# Altium project MB1312.PrjPCB (part 2 of 2)
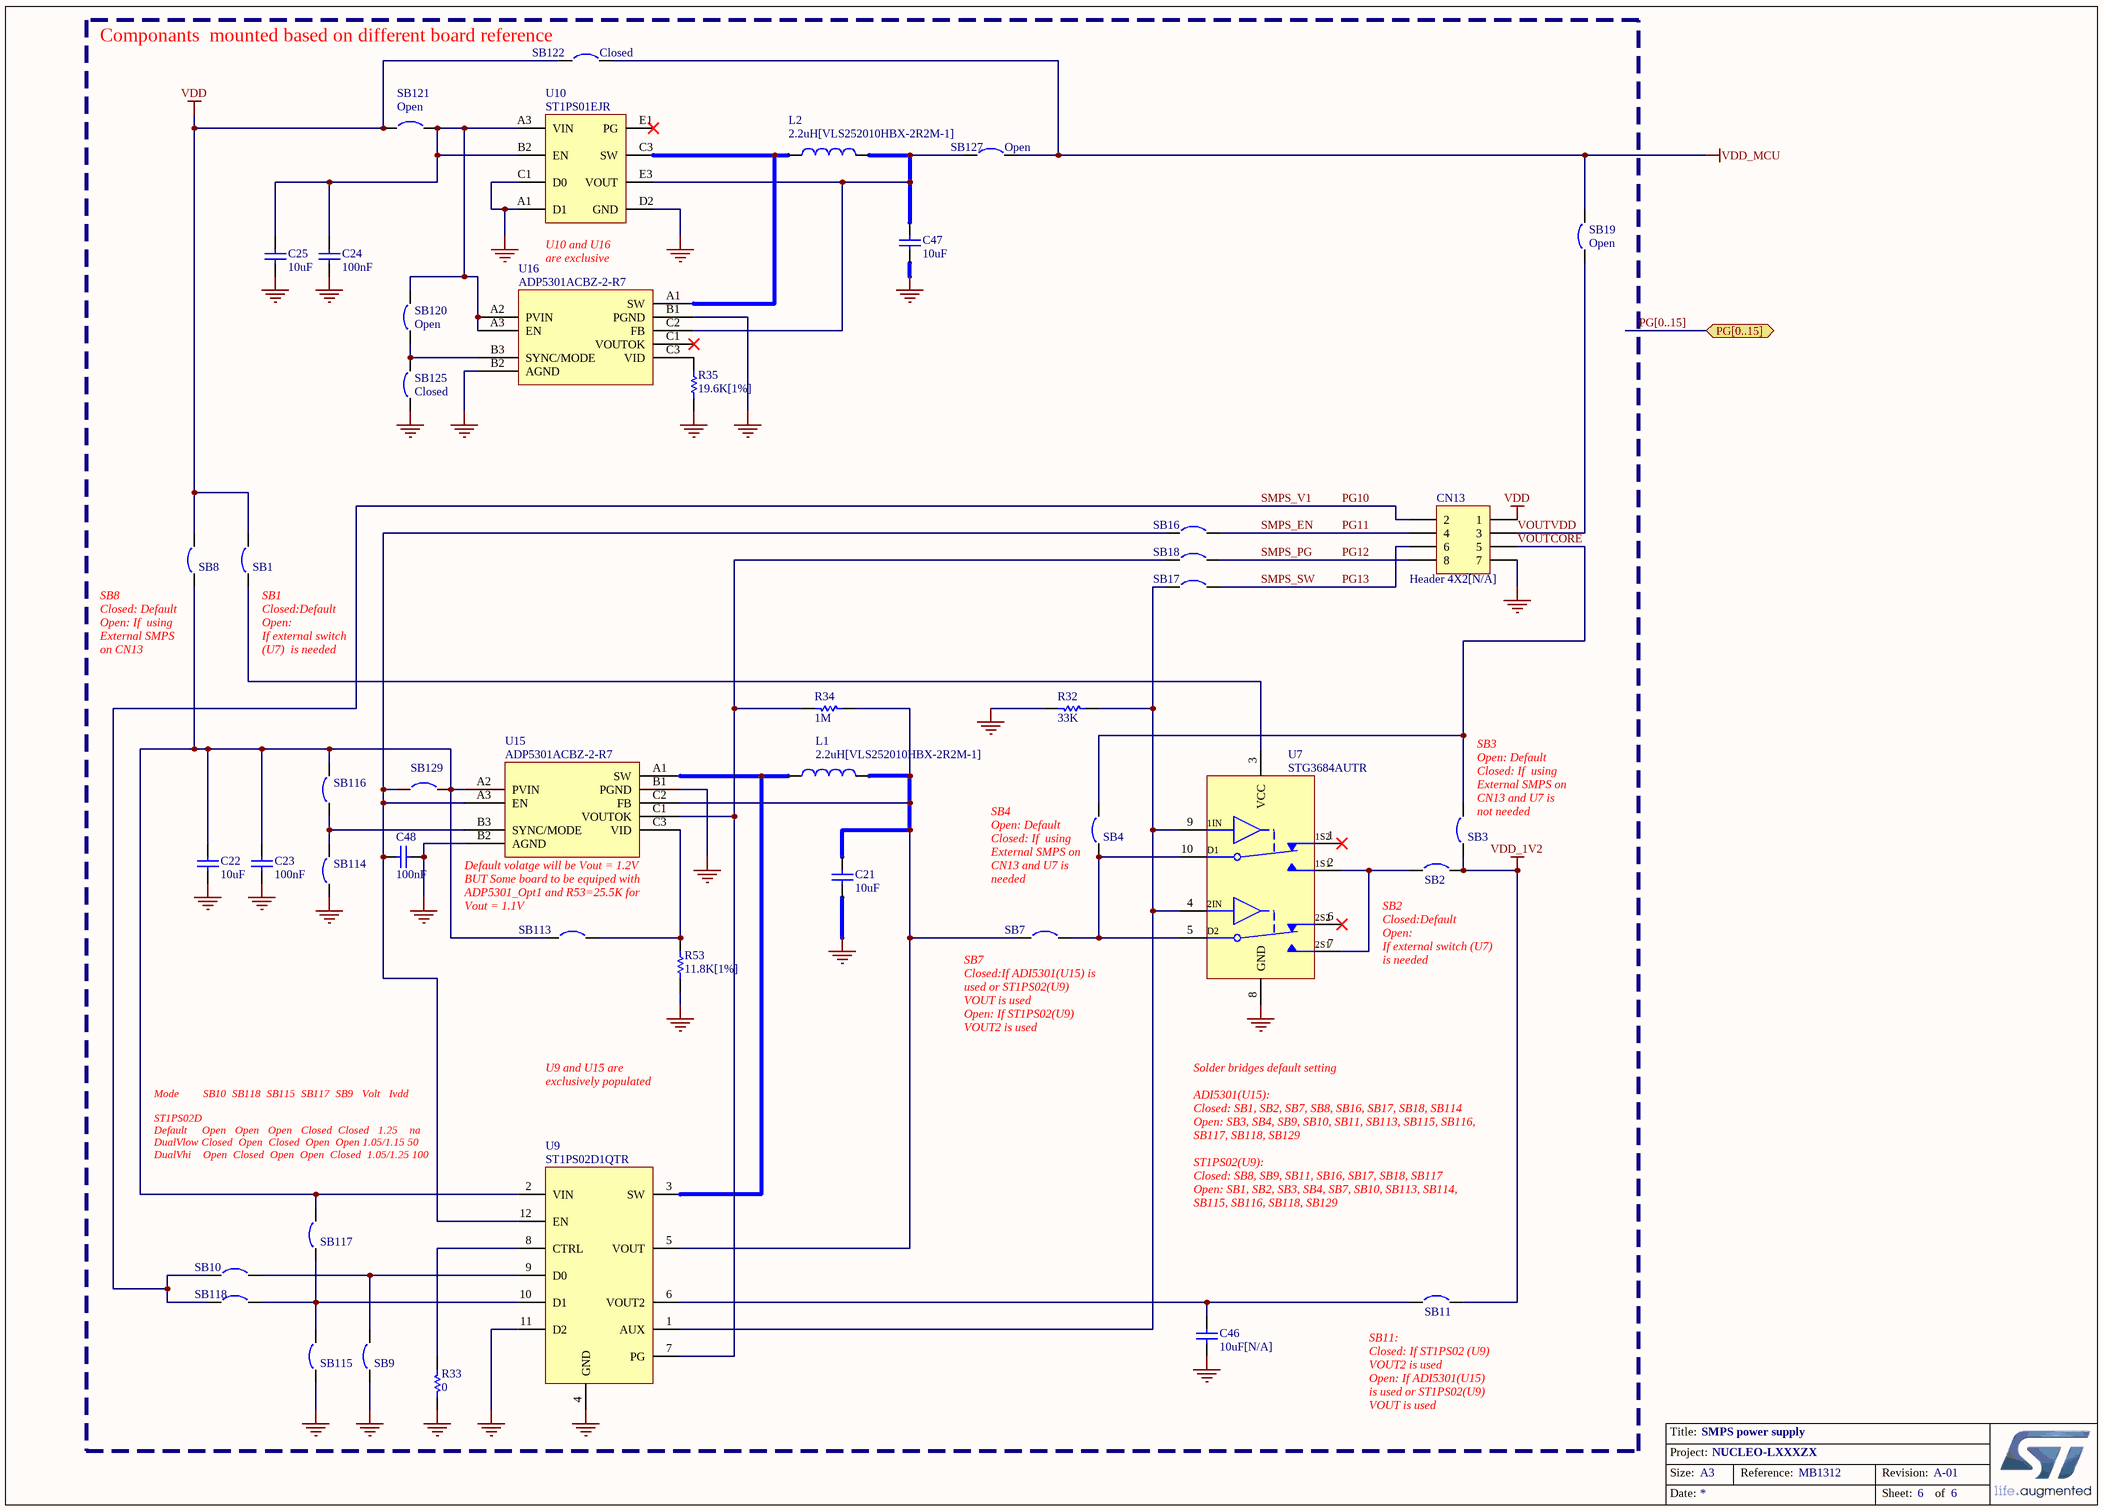
[diagram p6: SMPS power supply.SchDoc]

## Nets that join several sheets
+3V3: MB1312 (JP5.1 SB5.1 SB6.2), Connectors (CN8.7 CN11.16 SB111.1)
+3V3_PER: MB1312 (SB5.2), Connectors (SB110.1 U8.5), ST_LINK_V2-1 (R23.1), USB (R41.2 R45.2 R51.1)
+5V: MB1312 (9 pins), Connectors (CN8.9 CN11.18), ST_LINK_V2-1 (D2.1), USB (U12.5)
AGND: STM32L_144 (7 pins), Connectors (C45.2 CN10.3 CN12.32)
AVDD: STM32L_144 (5 pins), Connectors (CN10.1)
E5V: MB1312 (JP6.2), Connectors (CN11.6), ST_LINK_V2-1 (D3.1)
GND: MB1312 (14 pins), STM32L_144 (40 pins), Connectors (27 pins), ST_LINK_V2-1 (48 pins), USB (15 pins), SMPS power supply (27 pins)
U5V: MB1312 (6 pins), Connectors (CN12.8), ST_LINK_V2-1 (5 pins)
VBAT: STM32L_144 (C60.1 SB154.2 U11.6), Connectors (CN11.33)
VDD: MB1312 (JP5.2), STM32L_144 (8 pins), Connectors (CN11.5), SMPS power supply (5 pins)
VDD_1V2: STM32L_144 (C39.2 C55.2 SB15.2 SB139.2), SMPS power supply (SB2.2 SB3.1 SB11.2)
VDD_MCU: STM32L_144 (24 pins), Connectors (SB112.1), ST_LINK_V2-1 (C44.1 U14.8), SMPS power supply (SB19.2 SB122.2 SB127.2)
VIN: MB1312 (C18.1 U5.3), Connectors (CN8.15 CN11.24)
VIN_5V: MB1312 (C17.1 JP6.8 U5.2 U5.4), ST_LINK_V2-1 (D4.1)
VREF+: STM32L_144 (C56.1 C57.1 SB149.2 U11.32), Connectors (C45.1 SB119.1)
MCO: STM32L_144 (SB148.2), ST_LINK_V2-1 (SB109.1)
NetC42_1: STM32L_144 (R54.1), USB (6 pins)
NetCN6_1: STM32L_144 (SB131.2), ST_LINK_V2-1 (CN6.1 U2.13)
NetCN6_2: STM32L_144 (SB130.2), ST_LINK_V2-1 (CN6.2 U2.12)
NetCN14_2: STM32L_144 (SB142.1), USB (CN14.2 U13.1 U13.6)
NetCN14_3: STM32L_144 (SB143.1), USB (CN14.3 R50.1 U13.3 U13.4)
NetCN14_4: STM32L_144 (SB134.1), USB (CN14.4 D6.1)
NetJP4_1: STM32L_144 (JP4.1), USB (SB198.2 SB199.1)
NetR26_2: MB1312 (R26.2 U4.3), ST_LINK_V2-1 (U2.28)
NRST: STM32L_144 (B2.2 B2.3 C41.2 U11.25), Connectors (CN8.5 CN11.14), ST_LINK_V2-1 (JP3.2)
PA0: STM32L_144 (SB178.2 U11.34), Connectors (CN11.28 SB179.1)
PA1: STM32L_144 (U11.35), Connectors (CN10.11 CN11.30)
PA2: STM32L_144 (U11.36), Connectors (CN12.35 SB150.1)
PA3: STM32L_144 (U11.37), Connectors (CN9.1 CN12.37)
PA4: STM32L_144 (U11.40), Connectors (CN11.32 SB126.1 SB133.1)
PA5: STM32L_144 (U11.41), Connectors (CN7.10 CN12.11 SB123.2)
PA6: STM32L_144 (U11.42), Connectors (CN7.12 CN12.13)
PA7: STM32L_144 (U11.43), Connectors (CN7.14 CN12.15)
PA8: STM32L_144 (TP1.1 U11.100), Connectors (CN12.23)
PA9: STM32L_144 (SB135.2 U11.101), Connectors (CN12.21)
PA10: STM32L_144 (SB134.2 U11.102), Connectors (CN12.33)
PA11: STM32L_144 (SB142.2 U11.103), Connectors (CN12.14)
PA12: STM32L_144 (SB143.2 U11.104), Connectors (CN12.12)
PA13: STM32L_144 (U11.105), Connectors (CN11.13), ST_LINK_V2-1 (SB106.1)
PA14: STM32L_144 (U11.109), Connectors (CN11.15), ST_LINK_V2-1 (SB102.1)
PA15: STM32L_144 (U11.110), Connectors (CN11.17)
PB0: STM32L_144 (U11.46), Connectors (SB144.2 SB159.1 SB182.1)
PB1: STM32L_144 (U11.47), Connectors (CN10.7 CN12.24)
PB2: STM32L_144 (U11.48), Connectors (CN9.13 CN12.22)
PB3: STM32L_144 (SB161.2 SB162.2), Connectors (CN7.15 CN12.31), ST_LINK_V2-1 (SB141.2)
PB4: STM32L_144 (SB163.2 SB164.2), Connectors (CN12.27 SB128.1 SB140.1)
PB5: STM32L_144 (SB165.2 SB176.2), Connectors (CN7.13 CN12.29)
PB6: STM32L_144 (SB174.2 SB175.2), Connectors (CN9.15 CN12.17)
PB7: STM32L_144 (R30.1 SB172.2 SB173.2), Connectors (CN11.21)
PB8: STM32L_144 (SB181.2 SB184.2), Connectors (CN7.2 CN12.3 SB153.2)
PB9: STM32L_144 (SB185.2 SB186.2), Connectors (CN7.4 CN12.5 SB151.2)
PB10: STM32L_144 (U11.69), Connectors (CN12.25 SB155.1 SB188.2)
PB11: STM32L_144 (SB138.2), Connectors (CN10.34 CN12.18)
PB12: STM32L_144 (U11.73), Connectors (CN7.7 CN12.16)
PB13: STM32L_144 (U11.74), Connectors (CN7.5 CN12.30)
PB14: STM32L_144 (SB132.1 U11.75), Connectors (CN12.28)
PB15: STM32L_144 (U11.76), Connectors (CN7.3 CN12.26)
PC0: STM32L_144 (U11.26), Connectors (CN9.3 CN11.38)
PC1: STM32L_144 (U11.27), Connectors (CN9.7 CN11.36)
PC2: STM32L_144 (U11.28), Connectors (CN10.9 CN11.35)
PC3: STM32L_144 (U11.29), Connectors (CN9.5 CN11.37)
PC4: STM32L_144 (U11.44), Connectors (CN9.9 CN12.34 SB151.1)
PC5: STM32L_144 (U11.45), Connectors (CN9.11 CN12.6 SB153.1)
PC6: STM32L_144 (U11.96), Connectors (CN7.1 CN12.4)
PC7: STM32L_144 (U11.97), Connectors (CN12.19 SB124.1)
PC8: STM32L_144 (U11.98), Connectors (CN8.2 SB137.1)
PC9: STM32L_144 (U11.99), Connectors (CN8.4 SB136.1)
PC10: STM32L_144 (U11.111), Connectors (CN8.6 CN11.1)
PC11: STM32L_144 (U11.112), Connectors (CN8.8 CN11.2)
PC12: STM32L_144 (U11.113), Connectors (CN8.10 CN11.3)
PC13: STM32L_144 (SB197.1 U11.7), Connectors (CN11.23)
PC14: STM32L_144 (R39.2 U11.8), Connectors (SB145.1)
PC15: STM32L_144 (R40.2 U11.9), Connectors (SB146.1)
PD0: STM32L_144 (U11.114), Connectors (CN9.25 CN11.57)
PD1: STM32L_144 (U11.115), Connectors (CN9.27 CN11.55)
PD2: STM32L_144 (U11.116), Connectors (CN8.12 CN11.4)
PD3: STM32L_144 (U11.117), Connectors (CN9.10 CN11.40)
PD4: STM32L_144 (U11.118), Connectors (CN9.8 CN11.39)
PD5: STM32L_144 (U11.119), Connectors (CN9.6 CN11.41)
PD6: STM32L_144 (U11.122), Connectors (CN9.4 CN11.43)
PD7: STM32L_144 (U11.123), Connectors (CN9.2 CN11.45)
PD8: STM32L_144 (U11.77), Connectors (CN10.14 CN12.10)
PD9: STM32L_144 (U11.78), Connectors (CN10.16 CN11.69)
PD10: STM32L_144 (U11.79), Connectors (CN12.65)
PD11: STM32L_144 (U11.80), Connectors (CN12.45)
PD12: STM32L_144 (U11.81), Connectors (CN12.43)
PD13: STM32L_144 (U11.82), Connectors (CN12.41)
PD14: STM32L_144 (U11.85), Connectors (CN7.16 CN12.46)
PD15: STM32L_144 (U11.86), Connectors (CN7.18 CN12.48)
PE0: STM32L_144 (SB187.2 SB190.1), Connectors (CN10.33 CN12.64)
PE1: STM32L_144 (SB14.1 SB189.1), Connectors (CN11.61)
PE2: STM32L_144 (U11.1), Connectors (CN9.14 CN11.46)
PE3: STM32L_144 (U11.2), Connectors (CN9.22 CN11.47)
PE4: STM32L_144 (U11.3), Connectors (CN9.16 CN11.48)
PE5: STM32L_144 (U11.4), Connectors (CN9.18 CN11.50)
PE6: STM32L_144 (U11.5), Connectors (CN9.20 CN11.62)
PE7: STM32L_144 (U11.58), Connectors (CN10.20 CN12.44)
PE8: STM32L_144 (U11.59), Connectors (CN10.18 CN12.40)
PE9: STM32L_144 (U11.60), Connectors (CN10.4 CN12.52)
PE10: STM32L_144 (U11.63), Connectors (CN10.24 CN12.47)
PE11: STM32L_144 (U11.64), Connectors (CN10.6 CN12.56)
PE12: STM32L_144 (U11.65), Connectors (CN12.49 SB168.1 SB169.2)
PE13: STM32L_144 (U11.66), Connectors (CN10.10 CN12.55)
PE14: STM32L_144 (U11.67), Connectors (CN12.51 SB170.1 SB177.2)
PE15: STM32L_144 (U11.68), Connectors (CN12.53 SB157.1 SB180.2)
PF0: STM32L_144 (U11.10), Connectors (CN9.21 CN11.53)
PF1: STM32L_144 (U11.11), Connectors (CN9.19 CN11.51)
PF2: STM32L_144 (U11.12), Connectors (CN9.17 CN11.52)
PF3: STM32L_144 (U11.13), Connectors (CN8.14 CN12.58)
PF4: STM32L_144 (U11.14), Connectors (CN12.38)
PF5: STM32L_144 (U11.15), Connectors (CN8.16 CN12.36)
PF6: STM32L_144 (U11.18), Connectors (CN11.9)
PF7: STM32L_144 (U11.19), Connectors (CN9.26 CN11.11)
PF8: STM32L_144 (U11.20), Connectors (CN9.24 CN11.54)
PF9: STM32L_144 (U11.21), Connectors (CN9.28 CN11.56)
PF10: STM32L_144 (U11.22), Connectors (CN12.42)
PF11: STM32L_144 (U11.49), Connectors (CN12.62)
PF12: STM32L_144 (U11.50), Connectors (CN7.20 CN12.59)
PF13: STM32L_144 (U11.53), Connectors (CN10.2 CN12.57)
PF14: STM32L_144 (U11.54), Connectors (CN10.8 CN12.50)
PF15: STM32L_144 (U11.55), Connectors (CN10.12 CN12.60)
PG0: STM32L_144 (U11.56), Connectors (CN9.29 CN11.59)
PG1: STM32L_144 (U11.57), Connectors (CN9.30 CN11.58)
PG2: STM32L_144 (U11.87), Connectors (CN11.42)
PG3: STM32L_144 (U11.88), Connectors (CN11.44)
PG4: STM32L_144 (U11.89), Connectors (CN12.69)
PG5: STM32L_144 (JP4.2 U11.90), Connectors (CN12.68)
PG6: STM32L_144 (U11.91), Connectors (CN12.70), USB (SB200.1 SB201.1)
PG7: STM32L_144 (SB131.1 U11.92), Connectors (SB195.1)
PG8: STM32L_144 (SB130.1 U11.93), Connectors (SB193.2)
PG9: STM32L_144 (U11.124), Connectors (CN11.63)
PG10: STM32L_144 (U11.125), Connectors (SB192.2), SMPS power supply (CN13.2 SB10.1 SB118.1)
PG11: STM32L_144 (U11.126), Connectors (SB196.2), SMPS power supply (CN13.4 SB16.2)
PG12: STM32L_144 (U11.127), Connectors (SB191.1), SMPS power supply (CN13.8 SB18.2)
PG13: STM32L_144 (U11.128), Connectors (SB194.2), SMPS power supply (CN13.6 SB17.2)
PG14: STM32L_144 (U11.129), Connectors (CN12.61)
PG15: STM32L_144 (SB160.2), Connectors (CN11.64)
PH0: STM32L_144 (SB12.2 SB148.1 U11.23), Connectors (SB147.1)
PH1: STM32L_144 (SB13.2 U11.24), Connectors (SB156.1)
PH3-BOOT0: STM32L_144 (R38.1 SB171.2 SB183.2), Connectors (CN11.7)